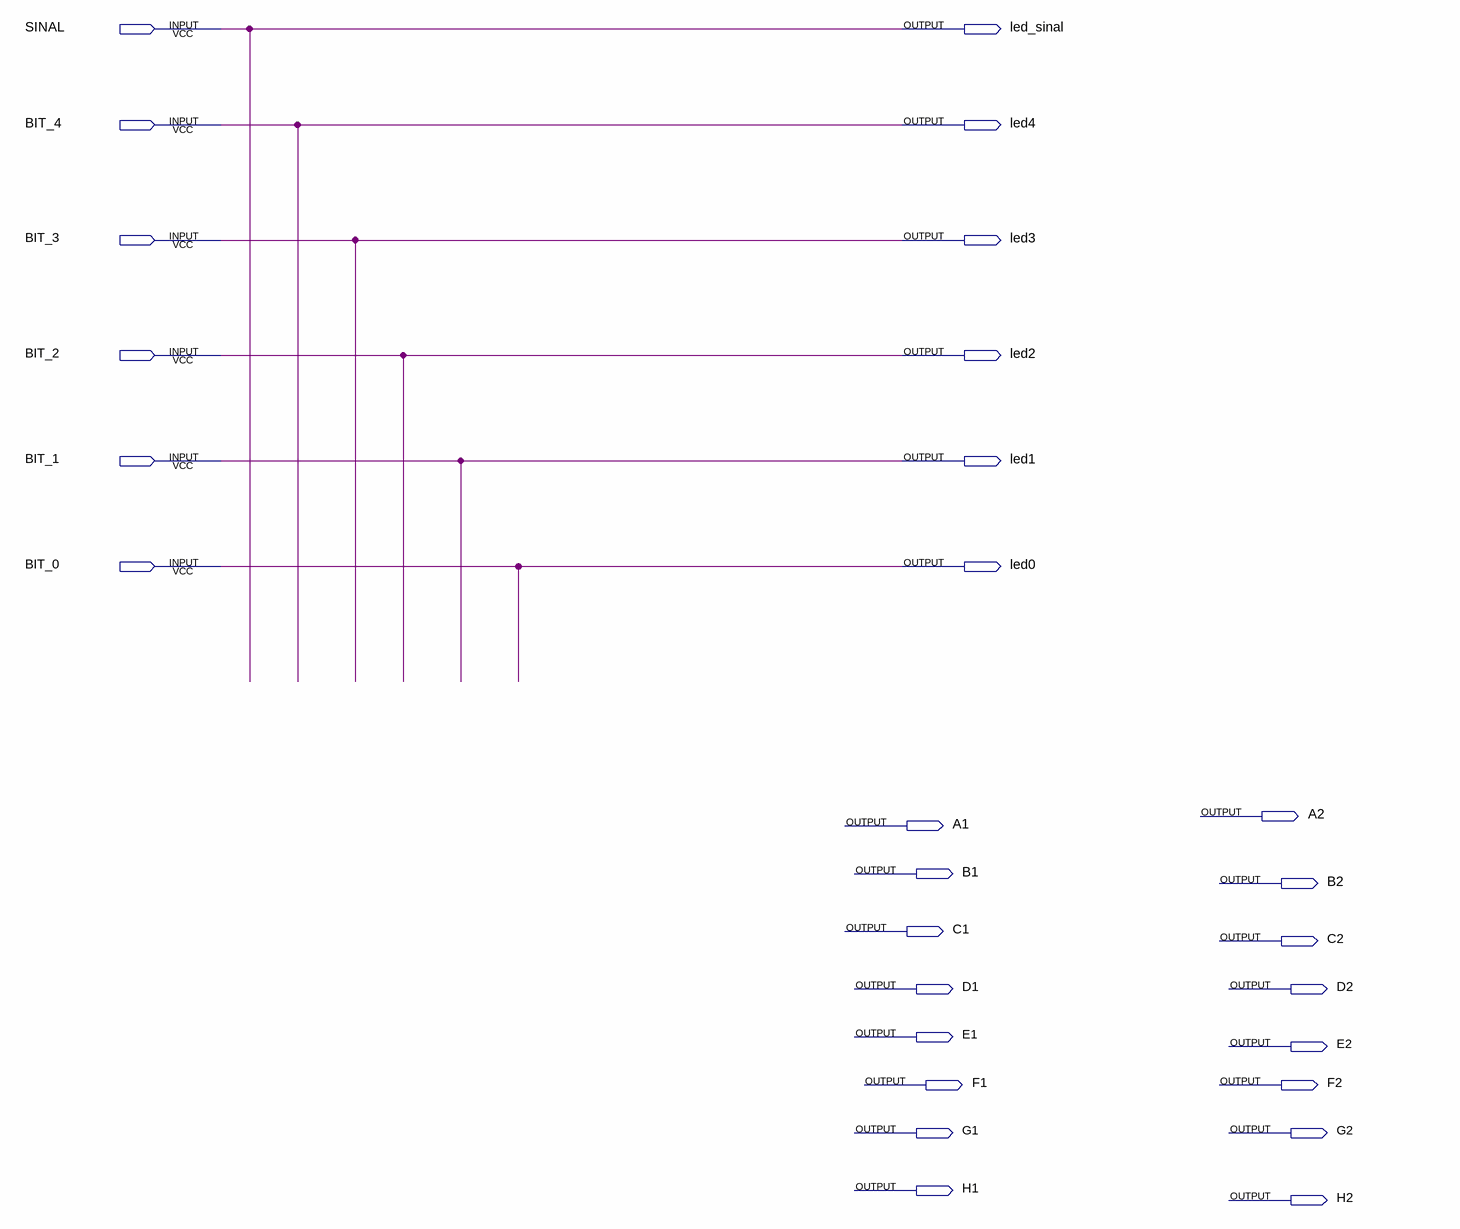
[diagram p0: schematic sheet]
// Quartus schematic DecodificadorDisplay.bdf as structural Verilog: 0 symbols, 28 pins
module DecodificadorDisplay (
  input  SINAL,
  input  BIT_4,
  input  BIT_3,
  input  BIT_2,
  input  BIT_1,
  input  BIT_0,
  output led_sinal,
  output led4,
  output led3,
  output led2,
  output led1,
  output led0,
  output A2,
  output A1,
  output B1,
  output B2,
  output C1,
  output C2,
  output D1,
  output D2,
  output E1,
  output E2,
  output F1,
  output F2,
  output G1,
  output G2,
  output H1,
  output H2
);


  assign led0 = BIT_0;
  assign led1 = BIT_1;
  assign led2 = BIT_2;
  assign led3 = BIT_3;
  assign led4 = BIT_4;
  assign led_sinal = SINAL;
endmodule
